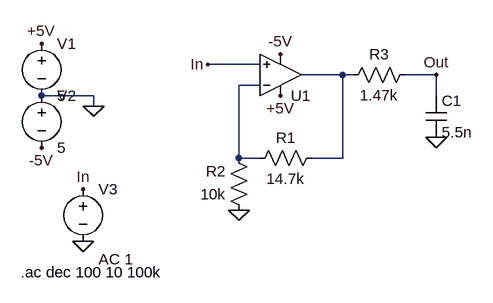
[diagram p0: schematic output_stage.asc]
output_stage.asc, the LTspice schematic file:
Version 4
SHEET 1 880 680
WIRE 144 96 64 96
WIRE 272 112 208 112
WIRE 288 112 272 112
WIRE 416 112 368 112
WIRE 144 128 112 128
WIRE -112 144 -192 144
WIRE 416 144 416 112
WIRE -112 160 -112 144
WIRE 112 240 112 128
WIRE 144 240 112 240
WIRE 272 240 272 112
WIRE 272 240 224 240
FLAG 176 80 -5V
FLAG 176 144 +5V
FLAG 112 320 0
FLAG 64 96 In
FLAG 416 208 0
FLAG 416 112 Out
FLAG -192 224 -5V
FLAG -192 64 +5V
FLAG -112 160 0
FLAG -128 368 0
FLAG -128 288 In
SYMBOL OpAmps\\UniversalOpAmp 176 112 M180
SYMATTR InstName U1
SYMBOL res 240 224 R90
WINDOW 0 0 56 VBottom 2
WINDOW 3 32 56 VTop 2
SYMATTR InstName R1
SYMATTR Value 14.7k
SYMBOL res 128 336 R180
WINDOW 0 36 76 Left 2
WINDOW 3 36 40 Left 2
SYMATTR InstName R2
SYMATTR Value 10k
SYMBOL res 384 96 R90
WINDOW 0 0 56 VBottom 2
WINDOW 3 32 56 VTop 2
SYMATTR InstName R3
SYMATTR Value 1.47k
SYMBOL cap 400 144 R0
SYMATTR InstName C1
SYMATTR Value 5.5n
SYMBOL voltage -192 48 R0
WINDOW 123 0 0 Left 0
WINDOW 39 0 0 Left 0
SYMATTR InstName V1
SYMATTR Value 5
SYMBOL voltage -192 128 R0
WINDOW 123 0 0 Left 0
WINDOW 39 0 0 Left 0
SYMATTR InstName V2
SYMATTR Value 5
SYMBOL voltage -128 272 R0
WINDOW 123 24 124 Left 2
WINDOW 39 0 0 Left 0
SYMATTR InstName V3
SYMATTR Value ""
SYMATTR Value2 AC 1
TEXT -224 416 Left 2 !.ac dec 100 10 100k

The netlist it stands for:
* output_stage.asc
XU1 In N002 +5V -5V N001 level1 Avol=1Meg GBW=10Meg Vos=0 En=0 Enk=0 In=0 Ink=0 Rin=500Meg  ; pins In+ In- V+ V- OUT
R1 N001 N002 14.7k
R2 0 N002 10k
R3 Out N001 1.47k
C1 Out 0 5.5n
V1 +5V 0 5
V2 0 -5V 5
V3 In 0 AC 1
.ac dec 100 10 100k
.lib UniversalOpAmp1.lib
.backanno
.end

* Results of the author's LTspice run, read from the files saved beside the schematic
* Operating Point, zero values left out:
*   V(+5v) = 5 V
*   V(-5v) = -5 V
*   I(V1) = -10 nA
*   I(V2) = -10 nA
*   Ix(u1:3) = 10 nA
*   Ix(u1:4) = -10 nA
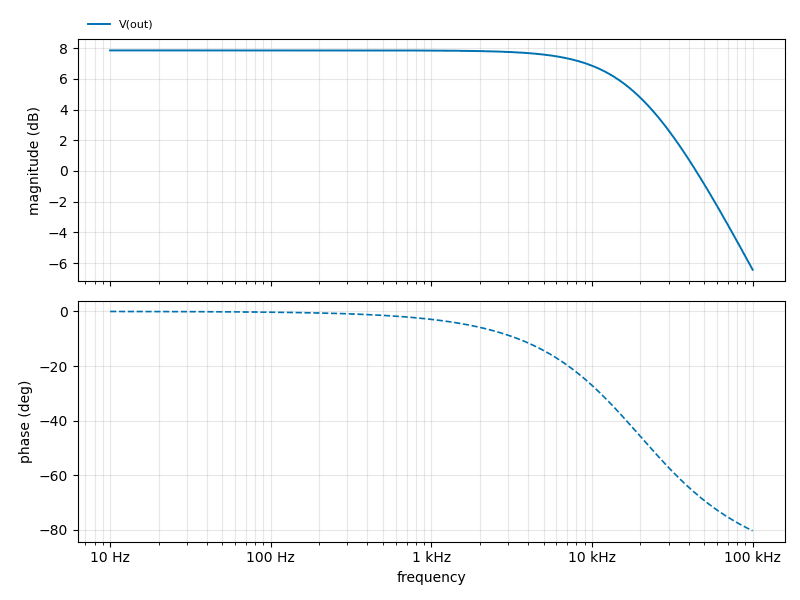
[diagram p1: AC Analysis of output_stage.asc, plotted from the saved traces]
* AC Analysis, 1 run:
*   V(out): 7.85 dB at 10 Hz, -6.43 dB at 100 kHz, peak 7.85 dB at 10 Hz, 3 dB below the peak at 19.68 kHz